# EAGLE schematic Fire_Alarm (EAGLE 7.5.0)
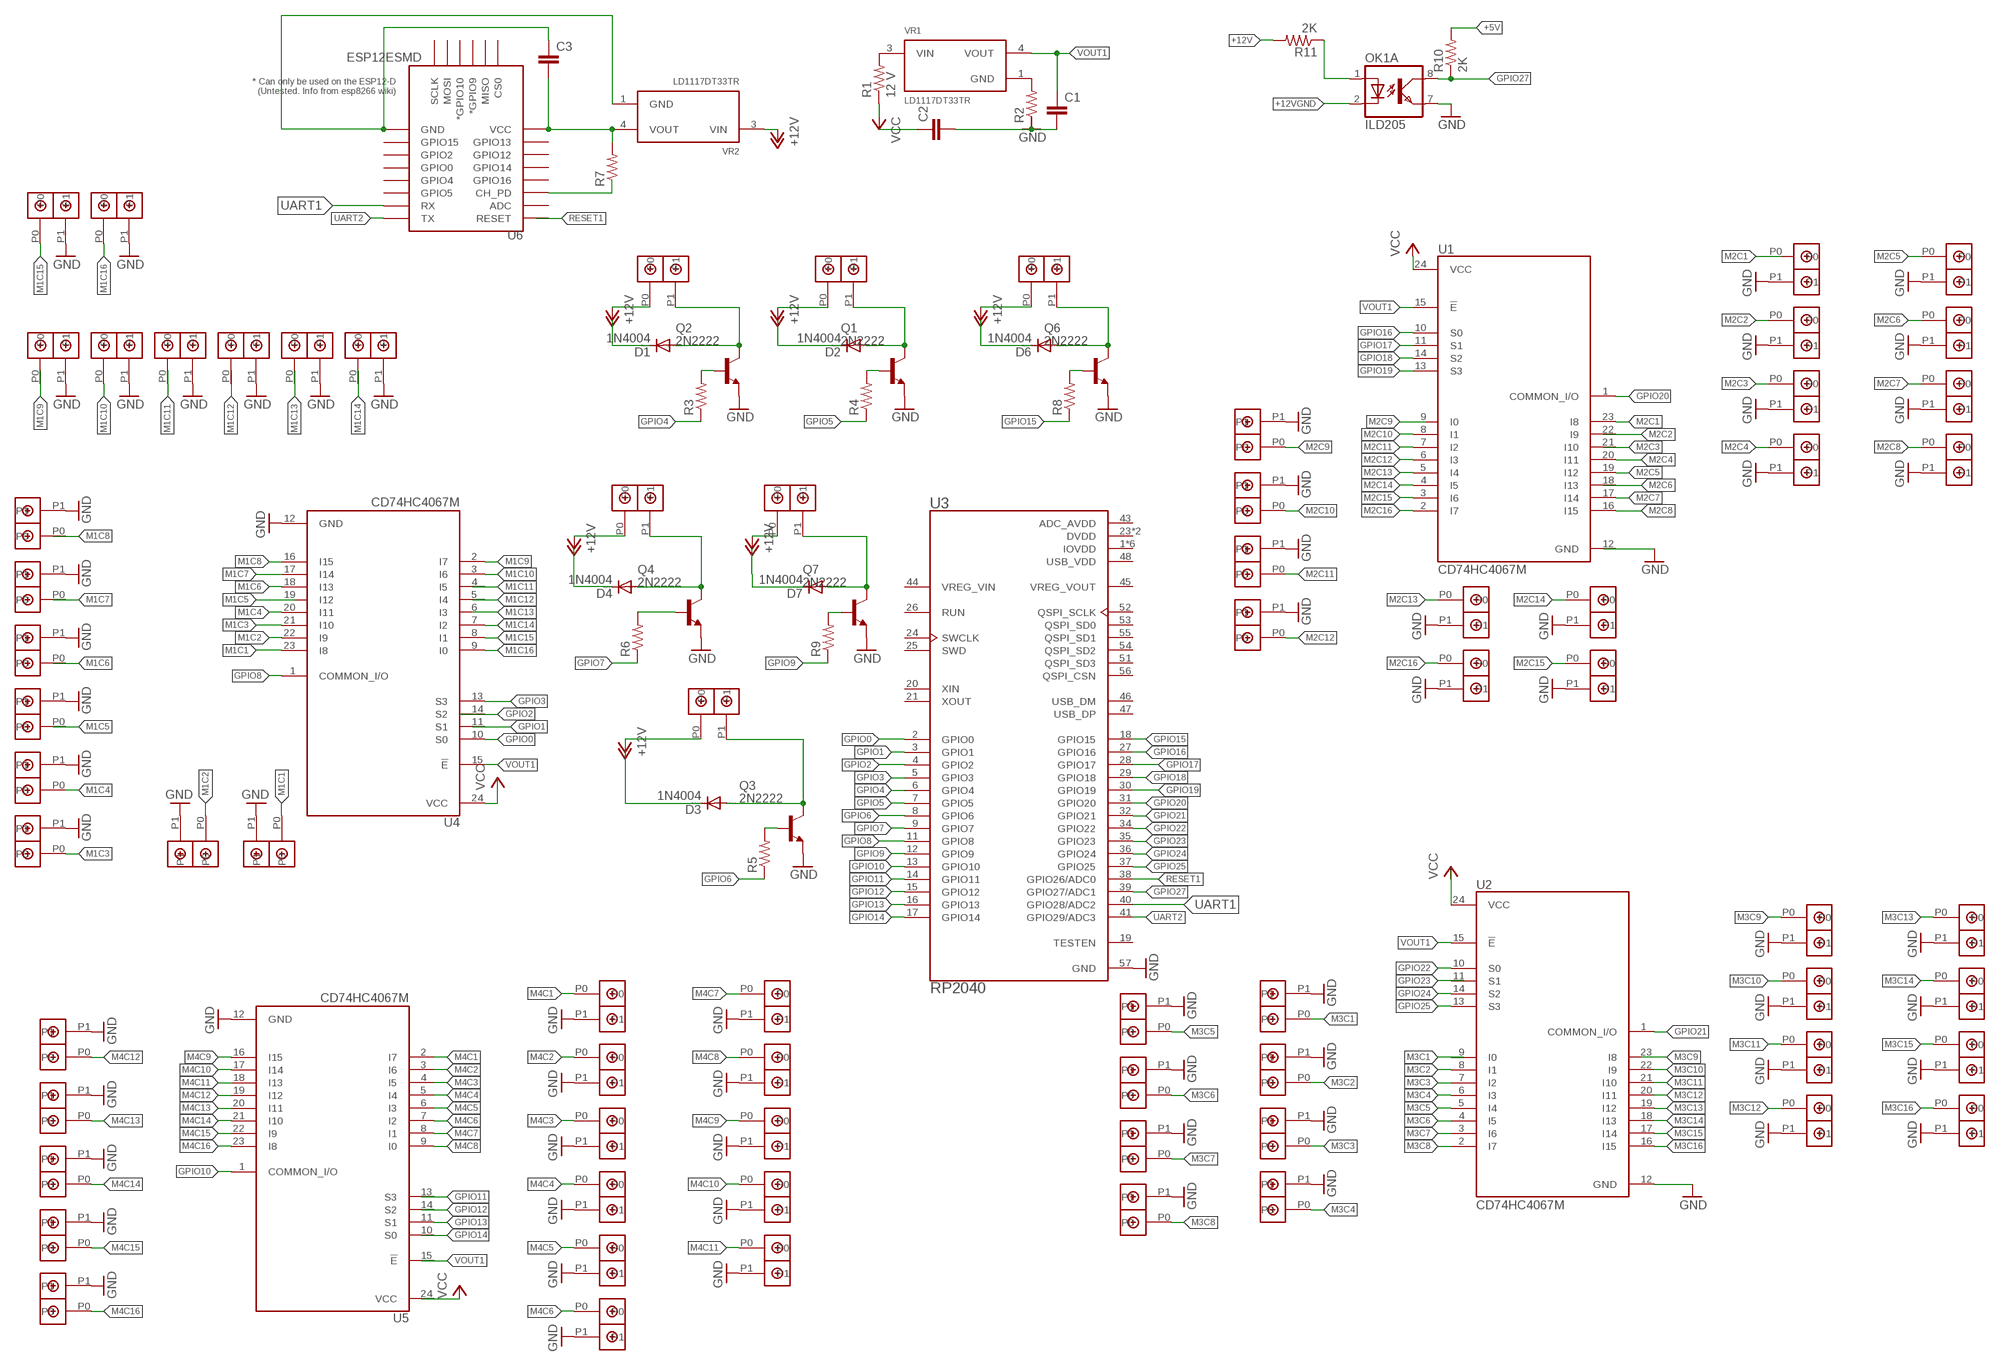
[diagram p0: schematic, sheet 1]

## Parts
C1  C2.5/2  [C2.5-2]
C2  C2.5/2  [C2.5-2]
C3  C5/5.5  [C5B5.5]
D1  1N4004  [DO41-10]
D2  1N4004  [DO41-10]
D3  1N4004  [DO41-10]
D4  1N4004  [DO41-10]
D6  1N4004  [DO41-10]
D7  1N4004  [DO41-10]
OK1  ILD205  [SOIC08]
Q1  2N2222  [TO18]
Q2  2N2222  [TO18]
Q3  2N2222  [TO18]
Q4  2N2222  [TO18]
Q6  2N2222  [TO18]
Q7  2N2222  [TO18]
R1  12 V  R-US_0204/7  [0204/7]
R2  R-US_0204/7  [0204/7]
R3  R-US_0204/5  [0204/5]
R4  R-US_0204/5  [0204/5]
R5  R-US_0204/5  [0204/5]
R6  R-US_0204/5  [0204/5]
R7  R-US_VTA55  [VTA55]
R8  R-US_0204/5  [0204/5]
R9  R-US_0204/5  [0204/5]
R10  2K  R-US_0204/2V  [0204V]
R11  2K  R-US_0204/2V  [0204V]
U1  CD74HC4067M  [SOIC127P1030X265-24N]
U2  CD74HC4067M  [SOIC127P1030X265-24N]
U3  RP2040  [QFN40P700X700X90-57N]
U4  CD74HC4067M  [SOIC127P1030X265-24N]
U5  CD74HC4067M  [SOIC127P1030X265-24N]
U6  ESP12ESMD  [ESP12E-SMD]
U$1  DBCONN-1X2  [DBCONN-1X2]
U$2  DBCONN-1X2  [DBCONN-1X2]
U$3  DBCONN-1X2  [DBCONN-1X2]
U$4  DBCONN-1X2  [DBCONN-1X2]
U$5  DBCONN-1X2  [DBCONN-1X2]
U$6  DBCONN-1X2  [DBCONN-1X2]
U$7  DBCONN-1X2  [DBCONN-1X2]
U$8  DBCONN-1X2  [DBCONN-1X2]
U$9  DBCONN-1X2  [DBCONN-1X2]
U$10  DBCONN-1X2  [DBCONN-1X2]
U$11  DBCONN-1X2  [DBCONN-1X2]
U$12  DBCONN-1X2  [DBCONN-1X2]
U$13  DBCONN-1X2  [DBCONN-1X2]
U$14  DBCONN-1X2  [DBCONN-1X2]
U$15  DBCONN-1X2  [DBCONN-1X2]
U$16  DBCONN-1X2  [DBCONN-1X2]
U$17  DBCONN-1X2  [DBCONN-1X2]
U$18  DBCONN-1X2  [DBCONN-1X2]
U$19  DBCONN-1X2  [DBCONN-1X2]
U$20  DBCONN-1X2  [DBCONN-1X2]
U$21  DBCONN-1X2  [DBCONN-1X2]
U$22  DBCONN-1X2  [DBCONN-1X2]
U$23  DBCONN-1X2  [DBCONN-1X2]
U$24  DBCONN-1X2  [DBCONN-1X2]
U$25  DBCONN-1X2  [DBCONN-1X2]
U$26  DBCONN-1X2  [DBCONN-1X2]
U$27  DBCONN-1X2  [DBCONN-1X2]
U$28  DBCONN-1X2  [DBCONN-1X2]
U$29  DBCONN-1X2  [DBCONN-1X2]
U$30  DBCONN-1X2  [DBCONN-1X2]
U$31  DBCONN-1X2  [DBCONN-1X2]
U$32  DBCONN-1X2  [DBCONN-1X2]
U$33  DBCONN-1X2  [DBCONN-1X2]
U$34  DBCONN-1X2  [DBCONN-1X2]
U$35  DBCONN-1X2  [DBCONN-1X2]
U$36  DBCONN-1X2  [DBCONN-1X2]
U$37  DBCONN-1X2  [DBCONN-1X2]
U$38  DBCONN-1X2  [DBCONN-1X2]
U$39  DBCONN-1X2  [DBCONN-1X2]
U$40  DBCONN-1X2  [DBCONN-1X2]
U$41  DBCONN-1X2  [DBCONN-1X2]
U$42  DBCONN-1X2  [DBCONN-1X2]
U$43  DBCONN-1X2  [DBCONN-1X2]
U$44  DBCONN-1X2  [DBCONN-1X2]
U$45  DBCONN-1X2  [DBCONN-1X2]
U$47  DBCONN-1X2  [DBCONN-1X2]
U$48  DBCONN-1X2  [DBCONN-1X2]
U$49  DBCONN-1X2  [DBCONN-1X2]
U$50  DBCONN-1X2  [DBCONN-1X2]
U$51  DBCONN-1X2  [DBCONN-1X2]
U$52  DBCONN-1X2  [DBCONN-1X2]
U$54  DBCONN-1X2  [DBCONN-1X2]
U$55  DBCONN-1X2  [DBCONN-1X2]
U$57  DBCONN-1X2  [DBCONN-1X2]
U$58  DBCONN-1X2  [DBCONN-1X2]
U$59  DBCONN-1X2  [DBCONN-1X2]
U$60  DBCONN-1X2  [DBCONN-1X2]
U$61  DBCONN-1X2  [DBCONN-1X2]
U$62  DBCONN-1X2  [DBCONN-1X2]
U$63  DBCONN-1X2  [DBCONN-1X2]
U$64  DBCONN-1X2  [DBCONN-1X2]
U$65  DBCONN-1X2  [DBCONN-1X2]
U$66  DBCONN-1X2  [DBCONN-1X2]
U$67  DBCONN-1X2  [DBCONN-1X2]
U$68  DBCONN-1X2  [DBCONN-1X2]
U$69  DBCONN-1X2  [DBCONN-1X2]
U$70  DBCONN-1X2  [DBCONN-1X2]
U$71  DBCONN-1X2  [DBCONN-1X2]
U$72  DBCONN-1X2  [DBCONN-1X2]
U$73  DBCONN-1X2  [DBCONN-1X2]
VR1  LD1117DT33TR  [DPAK456P1010X240-3N]
VR2  LD1117DT33TR  [DPAK456P1010X240-3N]

## Nets
+5V: R10.2
+12V: R11.2 U$57.P0 U$58.P0 U$69.P0 U$70.P0 U$71.P0 U$72.P0 VR2.3(VIN)
+12VGND: OK1.2(A:C)
GND: OK1.7(A:EMIT) Q1.1(E) Q2.1(E) Q3.1(E) Q4.1(E) Q6.1(E) Q7.1(E) U2.12(GND) U3.57(GND) U4.12(GND) U5.12(GND) U$1.P1 U$2.P1 U$3.P1 U$4.P1 U$5.P1 U$6.P1 U$7.P1 U$8.P1 U$9.P1 U$10.P1 U$11.P1 U$12.P1 U$13.P1 U$14.P1 U$15.P1 U$16.P1 U$17.P1 U$18.P1 U$19.P1 U$20.P1 U$21.P1 U$22.P1 U$23.P1 U$24.P1 U$25.P1 U$26.P1 U$27.P1 U$28.P1 U$29.P1 U$30.P1 U$31.P1 U$32.P1 U$33.P1 U$34.P1 U$35.P1 U$36.P1 U$37.P1 U$38.P1 U$39.P1 U$40.P1 U$41.P1 U$42.P1 U$43.P1 U$44.P1 U$45.P1 U$47.P1 U$48.P1 U$49.P1 U$50.P1 U$51.P1 U$52.P1 U$54.P1 U$55.P1 U$59.P1 U$60.P1 U$61.P1 U$62.P1 U$63.P1 U$64.P1 U$65.P1 U$66.P1 U$67.P1 U$68.P1 U$73.P1
GPIO0: U3.2(GPIO0) U4.10(S0)
GPIO1: U3.3(GPIO1)
GPIO2: U3.4(GPIO2)
GPIO3: U3.5(GPIO3) U4.13(S3)
GPIO4: R3.1 U3.6(GPIO4)
GPIO5: R4.1 U3.7(GPIO5)
GPIO6: R5.1 U3.8(GPIO6)
GPIO7: R6.1 U3.9(GPIO7)
GPIO8: U3.11(GPIO8) U4.1(COMMON_I/O)
GPIO9: R9.1 U3.12(GPIO9)
GPIO10: U3.13(GPIO10) U5.1(COMMON_I/O)
GPIO11: U3.14(GPIO11)
GPIO12: U3.15(GPIO12)
GPIO13: U3.16(GPIO13) U5.11(S1)
GPIO14: U3.17(GPIO14)
GPIO15: R8.1 U3.18(GPIO15)
GPIO16: U1.10(S0) U3.27(GPIO16)
GPIO17: U1.11(S1) U3.28(GPIO17)
GPIO18: U1.14(S2) U3.29(GPIO18)
GPIO19: U1.13(S3) U3.30(GPIO19)
GPIO20: U1.1(COMMON_I/O) U3.31(GPIO20)
GPIO21: U2.1(COMMON_I/O) U3.32(GPIO21)
GPIO22: U2.10(S0) U3.34(GPIO22)
GPIO23: U3.35(GPIO23)
GPIO24: U2.14(S2) U3.36(GPIO24)
GPIO25: U2.13(S3) U3.37(GPIO25)
GPIO27: OK1.8(A:COL) R10.1 U3.39(GPIO27/ADC1)
M1C1: U4.23(I8) U$19.P0
M1C2: U4.22(I9) U$17.P0
M1C3: U4.21(I10) U$20.P0
M1C4: U4.20(I11) U$18.P0
M1C6: U4.18(I13)
M1C7: U4.17(I14)
M1C8: U4.16(I15)
M1C9: U4.2(I7)
M1C10: U4.3(I6)
M1C14: U4.7(I2)
M1C15: U4.8(I1) U$3.P0
M1C16: U4.9(I0) U$2.P0
M2C1: U1.23(I8)
M2C4: U1.20(I11) U$23.P0
M2C5: U1.19(I12) U$28.P0
M2C6: U$24.P0
M2C7: U1.17(I14)
M2C8: U1.16(I15)
M2C9: U$38.P0
M2C10: U1.8(I1) U$39.P0
M2C11: U1.7(I2) U$37.P0
M2C12: U1.6(I3) U$41.P0
M2C13: U1.5(I4) U$40.P0
M2C14: U1.4(I5) U$44.P0
M2C15: U1.3(I6) U$43.P0
M2C16: U1.2(I7) U$42.P0
M3C1: U$33.P0
M3C2: U2.8(I1) U$36.P0
M3C3: U2.7(I2) U$35.P0
M3C4: U2.6(I3) U$32.P0
M3C5: U2.5(I4) U$4.P0
M3C6: U2.4(I5) U$5.P0
M3C7: U2.3(I6) U$30.P0
M3C8: U2.2(I7) U$31.P0
M3C9: U$63.P0
M3C10: U2.22(I9) U$65.P0
M3C11: U2.21(I10) U$67.P0
M3C12: U2.20(I11) U$68.P0
M3C13: U2.19(I12) U$61.P0
M3C14: U2.18(I13) U$62.P0
M3C15: U2.17(I14) U$64.P0
M3C16: U2.16(I15) U$66.P0
M4C1: U5.2(I7) U$47.P0
M4C2: U5.3(I6) U$45.P0
M4C3: U5.4(I5) U$29.P0
M4C4: U5.5(I4) U$52.P0
M4C5: U5.6(I3) U$34.P0
M4C6: U5.7(I2) U$73.P0
M4C7: U5.8(I1) U$51.P0
M4C8: U5.9(I0) U$59.P0
M4C9: U5.16(I15) U$25.P0
M4C10: U5.17(I14) U$26.P0
M4C11: U5.18(I13) U$50.P0
M4C12: U5.19(I12) U$49.P0
M4C13: U5.20(I11) U$48.P0
M4C14: U5.21(I10) U$54.P0
M4C15: U5.22(I9) U$60.P0
M4C16: U5.23(I8) U$55.P0
N$1: U$22.P0
N$2: OK1.1(A:A) R11.1
N$13: U4.24(VCC)
N$14: U2.24(VCC)
N$90: R1.2 VR1.3(VIN)
N$91: R2.2 VR1.1(GND)
N$92: C1.2 C2.2 R2.1
N$93: C2.1
N$95: D1.A Q2.3(C) U$71.P1
N$96: Q2.2(B) R3.2
N$98: D1.C
N$99: Q1.2(B) R4.2
N$100: D2.A Q1.3(C) U$58.P1
N$101: D2.C
N$103: Q3.2(B) R5.2
N$104: D3.C
N$105: D3.A Q3.3(C) U$70.P1
N$107: Q4.2(B) R6.2
N$108: D4.C
N$109: D4.A Q4.3(C) U$57.P1
N$110: C3.2 R7.2 U6.VCC VR2.4(VOUT)
N$112: C3.1 U6.GND VR2.1(GND)
N$114: Q6.2(B) R8.2
N$116: D6.C
N$117: D6.A Q6.3(C) U$69.P1
N$118: Q7.2(B) R9.2
N$119: D7.C
N$120: D7.A Q7.3(C) U$72.P1
N$123: U6.CH_PD
RESET1: U3.38(GPIO26/ADC0)
UART1: U3.40(GPIO28/ADC2) U6.RXD0(RX)
UART2: U3.41(GPIO29/ADC3) U6.TXD0(TX)
VCC: R1.1 U1.24(VCC)
VOUT1: C1.1 U1.15(!E) U2.15(!E) U4.15(!E) VR1.4(VOUT)
Unconnected: OK1.3(B:A) OK1.4(B:C) OK1.5(B:EMIT) OK1.6(B:COL) R7.1 U1.9(I0) U1.18(I13) U1.21(I10) U1.22(I9) U2.9(I0) U2.11(S1) U2.23(I8) U3.19(TESTEN) U3.20(XIN) U3.21(XOUT) U3.24(SWCLK) U3.25(SWD) U3.26(RUN) U3.44(VREG_VIN) U3.45(VREG_VOUT) U3.46(USB_DM) U3.47(USB_DP) U3.51(QSPI_SD3) U3.52(QSPI_SCLK) U3.53(QSPI_SD0) U3.54(QSPI_SD2) U3.55(QSPI_SD1) U3.56(QSPI_CSN) U4.4(I5) U4.5(I4) U4.6(I3) U4.11(S1) U4.14(S2) U4.19(I12) U5.10(S0) U5.13(S3) U5.14(S2) U5.15(!E) U6.ADC U6.CS0 U6.GPIO0 U6.GPIO2 U6.GPIO4 U6.GPIO5 U6.GPIO9(*GPIO9) U6.GPIO10(*GPIO10) U6.GPIO12 U6.GPIO13 U6.GPIO14 U6.GPIO15 U6.GPIO16 U6.MISO U6.MOSI U6.RESET U6.SCLK U$1.P0 U$6.P0 U$7.P0 U$8.P0 U$9.P0 U$10.P0 U$11.P0 U$12.P0 U$13.P0 U$14.P0 U$15.P0 U$16.P0 U$21.P0 U$27.P0

## Power pins joined to a net without a drawn wire
ADC_AVDD: U3.43(ADC_AVDD)
DVDD: U3.23(DVDD) U3.50(DVDD)
GND: U1.12(GND)
IOVDD: U3.1(IOVDD) U3.10(IOVDD) U3.22(IOVDD) U3.33(IOVDD) U3.42(IOVDD) U3.49(IOVDD)
USB_VDD: U3.48(USB_VDD)
VCC: U5.24(VCC)

## Library data of the parts
C1-C3 = capacitor-wima:C: CAPACITOR naming: grid - package width
D1-D4 D6 D7 = diode:1N4004: DIODE general purpose rectifier, 1 A
OK1 = optocoupler:ILD2*: Siemens ILD205/206/207/211/213/217 DUAL PHOTOTRANSISTOR SMALL OUTLINE SURFACE MOUNT OPTOCOUPLER Source: 153385-da-01-en-Optocoupler_ILD205-T.pdf; MF: VISHAY/TELEFUNKEN; MPN: ILD205T; OC_FARNELL: 1469512; OC_NEWARK: 20H8678
Q1-Q4 Q6 Q7 = transistor-npn:2N2222*: NPN Transistor
R1-R11 = resistor:R-US_: RESISTOR, American symbol
U1 U2 U4 U5 = CD74HC4067M:CD74HC4067M: 5-V, 16:1, 1-channel analog multiplexer Check availability <https://pricing.snapeda.com/parts/CD74HC4067M/Texas%20Instruments/view-part?ref=eda>; AVAILABILITY: In Stock; CHECK_PRICES: https://www.snapeda.com/parts/CD74HC4067M/Texas+Instruments/view-part/?ref=eda; DESCRIPTION: 5-V, 16:1, 1-channel analog multiplexer; MF: Texas Instruments; MP: CD74HC4067M; PACKAGE: SOIC-24 Texas Instruments; PRICE: None; SNAPEDA_LINK: https://www.snapeda.com/parts/CD74HC4067M/Texas+Instruments/view-part/?ref=snap
U3 = RP2040:RP2040: Check availability <https://pricing.snapeda.com/parts/RP2040/Raspberry%20Pi/view-part?ref=eda>; AVAILABILITY: In Stock; CHECK_PRICES: https://www.snapeda.com/parts/RP2040/Raspberry+Pi/view-part/?ref=eda; DESCRIPTION: RP2040 chip for Raspberry Pi Pico - ARM® Cortex®-M0+ MCU 32-Bit; MF: Raspberry Pi; MP: RP2040; PACKAGE: None; PRICE: None; PURCHASE-URL: https://www.snapeda.com/api/url_track_click_mouser/?unipart_id=5800506&manufacturer=Raspberry Pi&part_name=RP2040&search_term=rp2040; SNAPEDA_LINK: https://www.snapeda.com/parts/RP2040/Raspberry+Pi/view-part/?ref=snap
U6 = ESP12E:ESP12E: ESP12E Module Check availability <https://pricing.snapeda.com/parts/ESP-12E/AI-Thinker/view-part?ref=eda>; AVAILABILITY: Not in stock; CHECK_PRICES: https://www.snapeda.com/parts/ESP-12E/AI-Thinker/view-part/?ref=eda; DESCRIPTION: FLEXYPIN ADAPTER - ESP-07/ESP-12; MF: AI-Thinker; MP: ESP-12E; PACKAGE: Package; PRICE: None; SNAPEDA_LINK: https://www.snapeda.com/parts/ESP-12E/AI-Thinker/view-part/?ref=snap
U$1-U$45 U$47-U$52 U$54 U$55 U$57-U$73 = Terminal Block Connector:DBCONN-1X2
VR1 VR2 = LD1117DT33TR:LD1117DT33TR: LD1117 Series 1300 mA 3.3 V Fixed SMT Positive Voltage Regulator - TO-252 Check availability <https://pricing.snapeda.com/parts/LD1117DT33TR/STMicroelectronics/view-part?ref=eda>; AVAILABILITY: In Stock; CHECK_PRICES: https://www.snapeda.com/parts/LD1117DT33TR/STMicroelectronics/view-part/?ref=eda; DESCRIPTION: Linear Voltage Regulator IC Positive Fixed 1 Output 800mA DPAK; MF: STMicroelectronics; MP: LD1117DT33TR; PACKAGE: DPAK STMicroelectronics; PRICE: None; PURCHASE-URL: https://www.snapeda.com/api/url_track_click_mouser/?unipart_id=8105&manufacturer=STMicroelectronics&part_name=LD1117DT33TR&search_term=ld1117; SNAPEDA_LINK: https://www.snapeda.com/parts/LD1117DT33TR/STMicroelectronics/view-part/?ref=snap